# Altium schematic sheet NEW_POWER.SchDoc
size A4
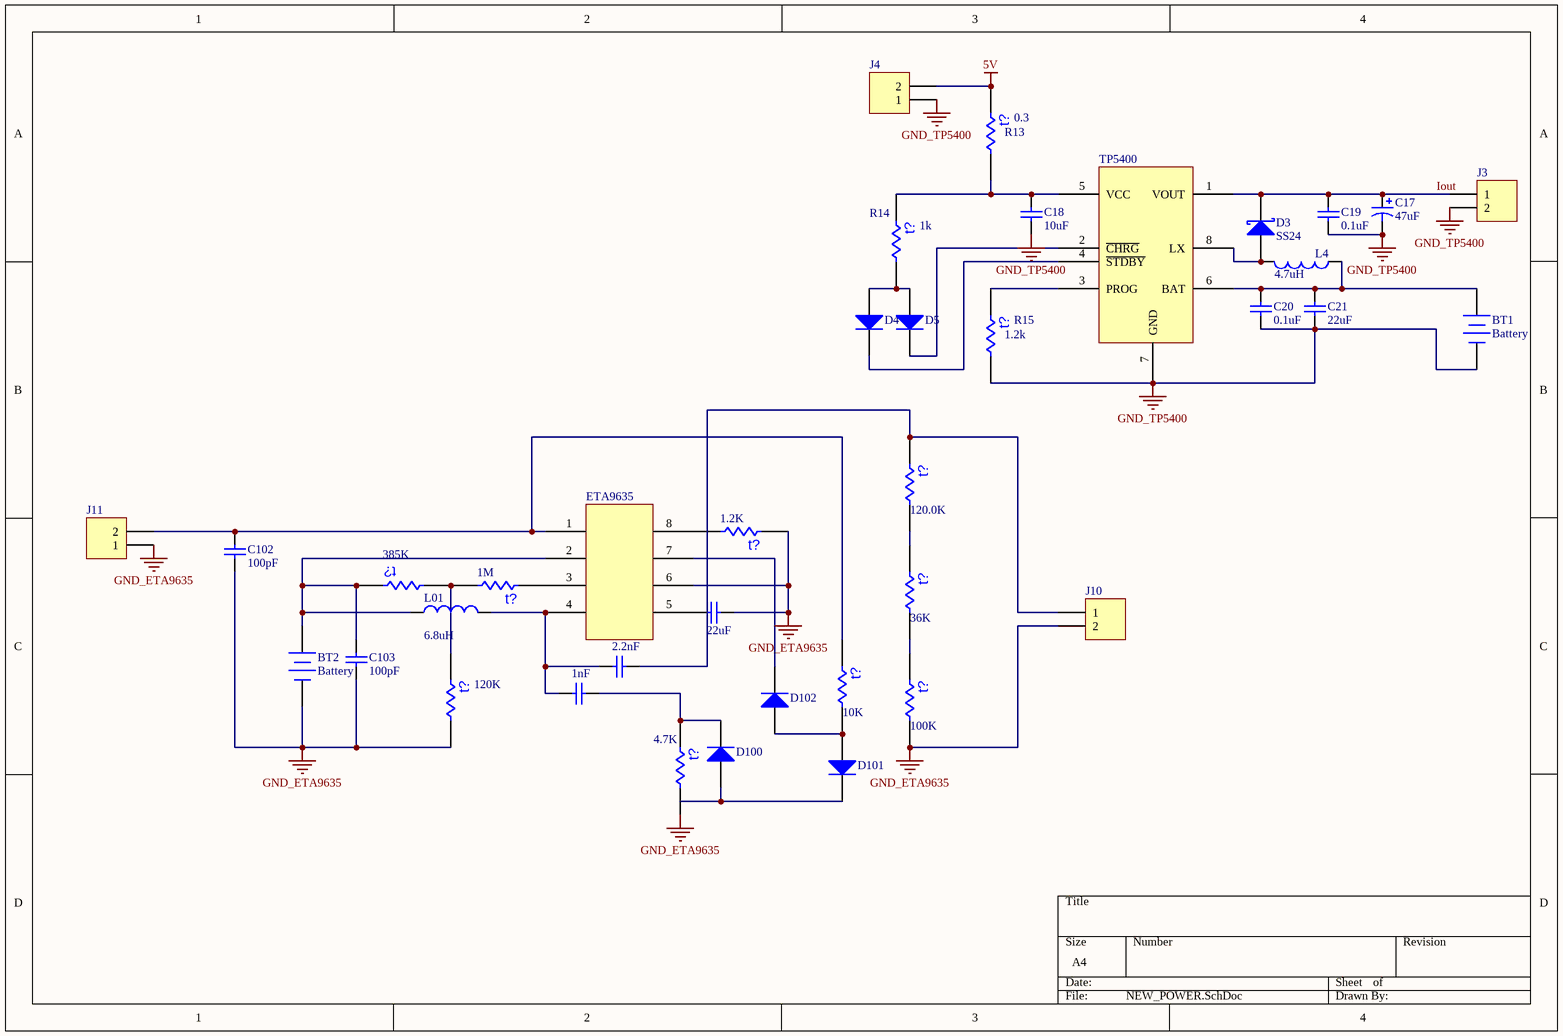
[diagram p0: NEW_POWER.SchDoc]

## Parts
1.2K  (no value)  [6-0805]
1M  (no value)  [6-0805]
1nF  (no value)  [PCBComponent_1]
2.2nF  (no value)  [PCBComponent_1]
4.7K  (no value)  [6-0805]
10K  (no value)  [6-0805]
36K  (no value)  [6-0805]
100K  (no value)  [6-0805]
120.0K  (no value)  [6-0805]
120K  (no value)  [6-0805]
385K  (no value)  [6-0805]
?  value 22uF  [PCBComponent_1]
BT1  Battery  [BAT-2]
BT2  Battery  [BAT-2]
C17  value 47uF  [3225[1210]]
C18  value 10uF  [PCBComponent_1]
C19  value 0.1uF  [PCBComponent_1]
C20  value 0.1uF  [PCBComponent_1]
C21  value 22uF  [C1210]
C102  value 100pF  [PCBComponent_1]
C103  value 100pF  [PCBComponent_1]
D3  SS24  [CAPM4227X18N]
D4  (no value)  [PCBComponent_1]
D5  (no value)  [PCBComponent_1]
D100  (no value)  [PCBComponent_1]
D101  (no value)  [PCBComponent_1]
D102  (no value)  [PCBComponent_1]
ETA9635  (no value)  [SOP-8]
J3  (no value)  [HDR1X2]
J4  (no value)  [HDR1X2]
J10  (no value)  [HDR1X2]
J11  (no value)  [HDR1X2]
L01  value 6.8uH  [INDP7474X40N]
L4  value 4.7uH  [INDP7474X40N]
R13  0.3  [6-0805]
R14  1k  [6-0805]
R15  1.2k  [6-0805]
TP5400  (no value)  [SOP127P600X175-8N]

## Nets
5V: J4.2 R13.1
GND_ETA9635: 1.2K.1 4.7K.2 100K.2 120K.2 ?.1 BT2.2(-) C102.1 C103.1 ETA9635.6 J10.2 J11.1
GND_TP5400: BT1.2(-) C17.2 C18.1 C19.1 C20.1 C21.1 J3.2 J4.1 R15.2 TP5400.7(GND)
Iout: C17.1 C19.2 D3.2(K) J3.1 TP5400.1(VOUT)
Net1.2K_2: 1.2K.2 ETA9635.8
Net1M_1: 1M.1 ETA9635.3
Net1M_2: 1M.2 120K.1 385K.2
Net1nF_1: 1nF.1 2.2nF.1 ETA9635.4 L01.2
Net1nF_2: 1nF.2 4.7K.1 D100.2(K)
Net2.2nF_2: 2.2nF.2 120.0K.1 J10.1
Net10K_1: 10K.1 C102.2 ETA9635.1 J11.2
Net10K_2: 10K.2 D101.1(A) D102.1(A)
Net36K_1: 36K.1 120.0K.2
Net36K_2: 36K.2 100K.1
Net385K_1: 385K.1 BT2.1(+) C103.2 ETA9635.2 L01.1
Net?_2: ?.2 ETA9635.5
NetBT1_1: BT1.1(+) C20.2 C21.2 L4.1 TP5400.6(BAT)
NetC18_2: C18.2 R13.2 R14.1 TP5400.5(VCC)
NetD3_1: D3.1(A) L4.2 TP5400.8(LX)
NetD4_1: D4.1(A) D5.1(A) R14.2
NetD4_2: D4.2(K) TP5400.4(~{STDBY})
NetD5_2: D5.2(K) TP5400.2(~{CHRG})
NetD100_1: D100.1(A) D101.2(K)
NetD102_2: D102.2(K) ETA9635.7
NetR15_1: R15.1 TP5400.3(PROG)

## Notes on the sheet
- (in symbol Res Thermal) t?

## Library data of the parts
1.2K 1M 4.7K 10K 36K 100K 120.0K 120K 385K = Res Thermal: Thermistor; Published: 24-Mar-1999; LatestRevisionDate: 04-Mar-2005; LatestRevisionNote: PCB Footprint replaced.; PackageReference: 6-0805; Publisher: Altium Limited
1nF 2.2nF ? C18-C21 C102 C103 = Cap Semi: Capacitor (Semiconductor SIM Model); Published: 8-Jun-2000; LatestRevisionDate: 17-Jul-2002; LatestRevisionNote: Re-released for DXP Platform.; PackageReference: C1206; Publisher: Altium Limited
BT1 BT2 = Battery: Multicell Battery; Published: 24-Mar-1999; LatestRevisionDate: 17-Jul-2002; LatestRevisionNote: Re-released for DXP Platform.; PackageReference: BAT-2; Publisher: Altium Limited
C17 = Cap Pol3: Polarized Capacitor (Surface Mount); Published: 8-Jun-2000; LatestRevisionDate: 17-Jul-2002; LatestRevisionNote: Re-released for DXP Platform.; PackageReference: C0805; Publisher: Altium Limited
D3 = Diode 11DQ03: Schottky Rectifier; Published: 8-Jun-2000; LatestRevisionDate: 17-Jul-2002; LatestRevisionNote: Re-released for DXP Platform.; DatasheetDocument: Dec-1997; PackageReference: DO-204AL; Publisher: Altium Limited; Code_JEDEC: DO-204-AL; ComponentLink1Description: Manufacturer Link; ComponentLink1URL: http://www.irf.com/; ComponentLink2Description: Datasheet; ComponentLink2URL: http://www.irf.com/product-info/datasheets/data/11dq03.pdf
D4 D5 D100-D102 = Diode 1N4005: 1 Amp General Purpose Rectifier; Published: 8-Jun-2000; LatestRevisionDate: 17-Jul-2002; LatestRevisionNote: Re-released for DXP Platform.; DatasheetDocument: 1998; PackageDocument: Aug-1999; PackageReference: DO-41; Publisher: Altium Limited; Code_JEDEC: DO-204-AL; ComponentLink1Description: Manufacturer Link; ComponentLink1URL: http://www.fairchildsemi.com/; ComponentLink2Description: Datasheet; ComponentLink2URL: http://www.fairchildsemi.com/ds/1N%2F1N4001.pdf
ETA9635 TP5400 = Component_1
J3 J4 J10 J11 = Header 2: Header, 2-Pin; LatestRevisionDate: 17-Jul-2002; LatestRevisionNote: Re-released for DXP Platform.; Publisher: Altium Limited
L01 L4 = Inductor: Code_IEC: 1005; Published: 8-Jun-2000; LatestRevisionDate: 17-Jul-2002; LatestRevisionNote: Re-released for DXP Platform.; PackageReference: 0402-A; Publisher: Altium Limited; Code_JEITA: 0402
R13-R15 = Res Thermal: Published: 24-Mar-1999; LatestRevisionDate: 04-Mar-2005; LatestRevisionNote: PCB Footprint replaced.; PackageReference: 6-0805; Publisher: Altium Limited